# Altium schematic sheet UCD3138 Digital Controller.SchDoc: UCD3138
size A4; Author: Enzo.sun; CompanyName: https://sunze.xyz/; Organization: Enze Co.; Revision: V1.0
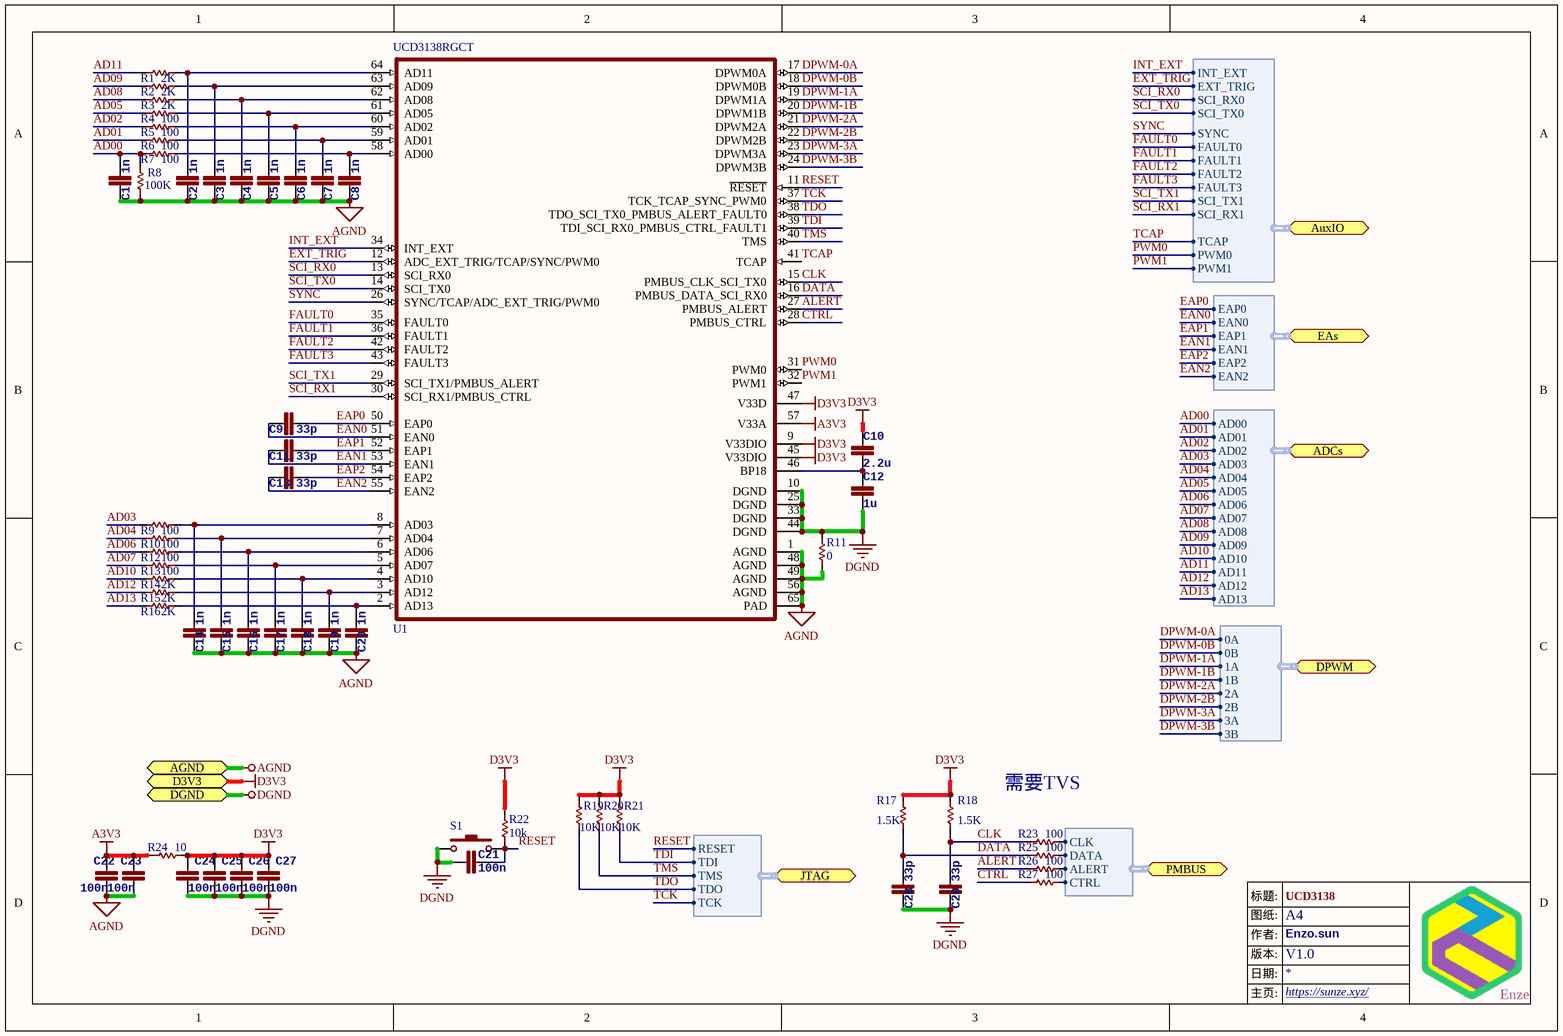
[diagram p0: UCD3138 Digital Controller.SchDoc]

## Parts
C1  1n  [0603-R/C-YG]
C2  1n  [0603-R/C-YG]
C3  1n  [0603-R/C-YG]
C4  1n  [0603-R/C-YG]
C5  1n  [0603-R/C-YG]
C6  1n  [0603-R/C-YG]
C7  1n  [0603-R/C-YG]
C8  1n  [0603-R/C-YG]
C9  33p  [0603-R/C-YG]
C10  2.2u  [0603-R/C-YG]
C11  33p  [0603-R/C-YG]
C12  1u  [0603-R/C-YG]
C13  33p  [0603-R/C-YG]
C14  1n  [0603-R/C-YG]
C15  1n  [0603-R/C-YG]
C16  1n  [0603-R/C-YG]
C17  1n  [0603-R/C-YG]
C18  1n  [0603-R/C-YG]
C19  1n  [0603-R/C-YG]
C20  1n  [0603-R/C-YG]
C21  100n  [0603-R/C-YG]
C22  100n  [0603-R/C-YG]
C23  100n  [0603-R/C-YG]
C24  100n  [0603-R/C-YG]
C25  100n  [0603-R/C-YG]
C26  100n  [0603-R/C-YG]
C27  100n  [0603-R/C-YG]
C28  33p  [0603-R/C-YG]
C29  33p  [0603-R/C-YG]
R1  2K  [0603-R-B]
R2  2K  [0603-R-B]
R3  2K  [0603-R-B]
R4  100  [0603-R-B]
R5  100  [0603-R-B]
R6  100  [0603-R-B]
R7  100  [0603-R-B]
R8  100K  [0603-R-B]
R9  100  [0603-R-B]
R10  100  [0603-R-B]
R11  0  [0805R]
R12  100  [0603-R-B]
R13  100  [0603-R-B]
R14  2K  [0603-R-B]
R15  2K  [0603-R-B]
R16  2K  [0603-R-B]
R17  1.5K  [0603-R-B]
R18  1.5K  [0603-R-B]
R19  10K  [0603-R-B]
R20  10K  [0603-R-B]
R21  10K  [0603-R-B]
R22  10k  [0603-R-B]
R23  100  [0603-R-B]
R24  10  [0805R]
R25  100  [0603-R-B]
R26  100  [0603-R-B]
R27  100  [0603-R-B]
S1  SW-PB  [SW-SMD1]  (value not drawn)
UCD3138RGCT  U1  [VQFN-64]

## Ports
ADCs (harness ADCx14), AGND, AuxIO (harness AuxIO), D3V3, DGND, DPWM (harness DPWM), EAs (harness EA), JTAG (harness Debug), PMBUS (harness JTAG)

## Harnesses
Debug: TMS, TCK, TDI, TDO, RESET
DPWM: 0A, 0B, 1B, 1A, 2B, 2A, 3B, 3A
ADCx14: AD00, AD01, AD02, AD03, AD04, AD05, AD06, AD07, AD08, AD09, AD10, AD11, AD12, AD13
JTAG: ALERT, DATA, CTRL, CLK
EA: EAP0, EAP1, EAP2, EAN0, EAN1, EAN2
AuxIO: INT_EXT, SCI_RX1, TCAP, SCI_TX1, EXT_TRIG, SCI_RX0, SCI_TX0, SYNC, FAULT0, FAULT1, FAULT2, FAULT3, PWM0, PWM1

## Nets
A3V3: C22.2 C23.2 R24.2 UCD3138RGCT.57(V33A)
AGND: C1.1 C2.1 C3.1 C4.1 C5.1 C6.1 C7.1 C8.1 C14.1 C15.1 C16.1 C17.1 C18.1 C19.1 C20.1 C22.1 C23.1 R8.2 R11.2 UCD3138RGCT.1(AGND) UCD3138RGCT.48(AGND) UCD3138RGCT.49(AGND) UCD3138RGCT.56(AGND) UCD3138RGCT.65(PAD) ; port AGND
D3V3: C10.2 C24.2 C25.2 C26.2 C27.2 R17.2 R18.2 R19.2 R20.2 R21.2 R22.2 R24.1 UCD3138RGCT.9(V33DIO) UCD3138RGCT.45(V33DIO) UCD3138RGCT.47(V33D) ; port D3V3
DGND: C12.1 C21.1 C24.1 C25.1 C26.1 C27.1 C28.1 C29.1 R11.1 S1.1 UCD3138RGCT.10(DGND) UCD3138RGCT.25(DGND) UCD3138RGCT.33(DGND) UCD3138RGCT.44(DGND) ; port DGND
AD00: C1.2 R7.2 R8.1 ; port ADCs.AD00
AD01: R6.2 ; port ADCs.AD01
AD02: R5.2 ; port ADCs.AD02
AD03: R9.2 ; port ADCs.AD03
AD04: R10.2 ; port ADCs.AD04
AD05: R4.2 ; port ADCs.AD05
AD06: R12.2 ; port ADCs.AD06
AD07: R13.2 ; port ADCs.AD07
AD08: R3.2 ; port ADCs.AD08
AD09: R2.2 ; port ADCs.AD09
AD10: R14.2 ; port ADCs.AD10
AD11: R1.2 ; port ADCs.AD11
AD12: R15.2 ; port ADCs.AD12
AD13: R16.2 ; port ADCs.AD13
ALERT: R26.2 UCD3138RGCT.27(PMBUS_ALERT)
CLK: C29.2 R18.1 R23.2 UCD3138RGCT.15(PMBUS_CLK_SCI_TX0)
CTRL: R27.2 UCD3138RGCT.28(PMBUS_CTRL)
DATA: C28.2 R17.1 R25.2 UCD3138RGCT.16(PMBUS_DATA_SCI_RX0)
DPWM-0A: UCD3138RGCT.17(DPWM0A) ; port DPWM.0A
DPWM-0B: UCD3138RGCT.18(DPWM0B) ; port DPWM.0B
DPWM-1A: UCD3138RGCT.19(DPWM1A) ; port DPWM.1A
DPWM-1B: UCD3138RGCT.20(DPWM1B) ; port DPWM.1B
DPWM-2A: UCD3138RGCT.21(DPWM2A) ; port DPWM.2A
DPWM-2B: UCD3138RGCT.22(DPWM2B) ; port DPWM.2B
DPWM-3A: UCD3138RGCT.23(DPWM3A) ; port DPWM.3A
DPWM-3B: UCD3138RGCT.24(DPWM3B) ; port DPWM.3B
EAN0: C9.1 UCD3138RGCT.51(EAN0) ; port EAs.EAN0
EAN1: C11.1 UCD3138RGCT.53(EAN1) ; port EAs.EAN1
EAN2: C13.1 UCD3138RGCT.55(EAN2) ; port EAs.EAN2
EAP0: C9.2 UCD3138RGCT.50(EAP0) ; port EAs.EAP0
EAP1: C11.2 UCD3138RGCT.52(EAP1) ; port EAs.EAP1
EAP2: C13.2 UCD3138RGCT.54(EAP2) ; port EAs.EAP2
EXT_TRIG: UCD3138RGCT.12(ADC_EXT_TRIG/TCAP/SYNC/PWM0) ; port AuxIO.EXT_TRIG
FAULT0: UCD3138RGCT.35(FAULT0) ; port AuxIO.FAULT0
FAULT1: UCD3138RGCT.36(FAULT1) ; port AuxIO.FAULT1
FAULT2: UCD3138RGCT.42(FAULT2) ; port AuxIO.FAULT2
FAULT3: UCD3138RGCT.43(FAULT3) ; port AuxIO.FAULT3
INT_EXT: UCD3138RGCT.34(INT_EXT) ; port AuxIO.INT_EXT
PWM0: UCD3138RGCT.31(PWM0) ; port AuxIO.PWM0
PWM1: UCD3138RGCT.32(PWM1) ; port AuxIO.PWM1
RESET: C21.2 R22.1 S1.2 UCD3138RGCT.11(~{RESET}) ; port JTAG.RESET
SCI_RX0: UCD3138RGCT.13(SCI_RX0) ; port AuxIO.SCI_RX0
SCI_RX1: UCD3138RGCT.30(SCI_RX1/PMBUS_CTRL) ; port AuxIO.SCI_RX1
SCI_TX0: UCD3138RGCT.14(SCI_TX0) ; port AuxIO.SCI_TX0
SCI_TX1: UCD3138RGCT.29(SCI_TX1/PMBUS_ALERT) ; port AuxIO.SCI_TX1
SYNC: UCD3138RGCT.26(SYNC/TCAP/ADC_EXT_TRIG/PWM0) ; port AuxIO.SYNC
TCAP: UCD3138RGCT.41(TCAP) ; port AuxIO.TCAP
TCK: UCD3138RGCT.37(TCK_TCAP_SYNC_PWM0) ; port JTAG.TCK
TDI: R21.1 UCD3138RGCT.39(TDI_SCI_RX0_PMBUS_CTRL_FAULT1) ; port JTAG.TDI
TDO: R19.1 UCD3138RGCT.38(TDO_SCI_TX0_PMBUS_ALERT_FAULT0) ; port JTAG.TDO
TMS: R20.1 UCD3138RGCT.40(TMS) ; port JTAG.TMS
NetC2_2: C2.2 R1.1 UCD3138RGCT.64(AD11)
NetC3_2: C3.2 R2.1 UCD3138RGCT.63(AD09)
NetC4_2: C4.2 R3.1 UCD3138RGCT.62(AD08)
NetC5_2: C5.2 R4.1 UCD3138RGCT.61(AD05)
NetC6_2: C6.2 R5.1 UCD3138RGCT.60(AD02)
NetC7_2: C7.2 R6.1 UCD3138RGCT.59(AD01)
NetC8_2: C8.2 R7.1 UCD3138RGCT.58(AD00)
NetC10_1: C10.1 C12.2 UCD3138RGCT.46(BP18)
NetC14_2: C14.2 R9.1 UCD3138RGCT.8(AD03)
NetC15_2: C15.2 R10.1 UCD3138RGCT.7(AD04)
NetC16_2: C16.2 R12.1 UCD3138RGCT.6(AD06)
NetC17_2: C17.2 R13.1 UCD3138RGCT.5(AD07)
NetC18_2: C18.2 R14.1 UCD3138RGCT.4(AD10)
NetC19_2: C19.2 R15.1 UCD3138RGCT.3(AD12)
NetC20_2: C20.2 R16.1 UCD3138RGCT.2(AD13)
NetR23_1: R23.1 ; port PMBUS.CLK
NetR25_1: R25.1 ; port PMBUS.DATA
NetR26_1: R26.1 ; port PMBUS.ALERT
NetR27_1: R27.1 ; port PMBUS.CTRL

## Notes on the sheet
- 需要TVS
- 标题:
- 图纸:
- A4
- 作者:
- 日期:
- 版本:
- 主页:
- Enze

## Library data of the parts
C1-C29 = Capacitor-M: <B>CAPACITOR</B>, European symbol
R1-R27 = Resistor-E: 电阻; Sim Note: Enter the Resistance value and the set point into parameter fields.; Set Position: 0.5; Value: 1K; Published: 8-Jun-2000; LatestRevisionDate: 17-Jul-2002; LatestRevisionNote: Re-released for DXP Platform.; PackageReference: VR5; Publisher: Altium Limited
S1 = SW-PB: Switch; Published: 24-Mar-1999; LatestRevisionDate: 17-Jul-2002; LatestRevisionNote: Re-released for DXP Platform.; PackageReference: SPST-2; Publisher: Altium Limited; PackageDescription: Switch; 2 Leads
UCD3138RGCT = UCD3138RGCT: 64Pins